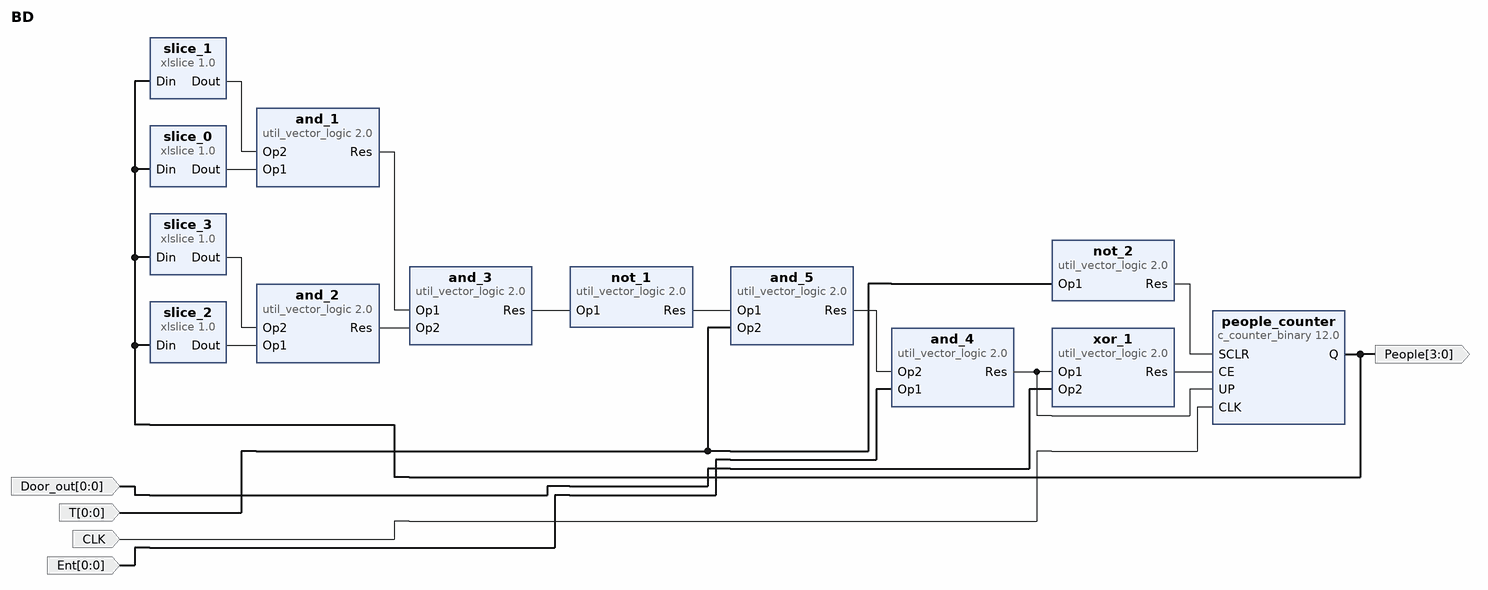
[diagram p0: block diagram of the top level]
# Vivado block design BD, xc7z020iclg400-1L, Vivado 2019.1
create_bd_design BD

create_bd_port -dir O -from 3 -to 0 -type data People
create_bd_port -dir I -from 0 -to 0 Door_out
create_bd_port -dir I -from 0 -to 0 T
create_bd_port -dir I -type clk CLK
set_property -dict {CONFIG.CLK_DOMAIN BD_CLK CONFIG.FREQ_HZ 10000000} [get_bd_ports CLK]
create_bd_port -dir I -from 0 -to 0 Ent

create_bd_cell -type ip -vlnv xilinx.com:ip:c_counter_binary:12.0 people_counter
set_property -dict {CONFIG.CE true CONFIG.Count_Mode UPDOWN CONFIG.Output_Width 4 CONFIG.SCLR true} [get_bd_cells people_counter]
create_bd_cell -type ip -vlnv xilinx.com:ip:xlslice:1.0 slice_0
set_property -dict {CONFIG.DIN_FROM 0 CONFIG.DIN_TO 0 CONFIG.DIN_WIDTH 4} [get_bd_cells slice_0]
create_bd_cell -type ip -vlnv xilinx.com:ip:xlslice:1.0 slice_1
set_property -dict {CONFIG.DIN_FROM 1 CONFIG.DIN_TO 1 CONFIG.DIN_WIDTH 4 CONFIG.DOUT_WIDTH 1} [get_bd_cells slice_1]
create_bd_cell -type ip -vlnv xilinx.com:ip:xlslice:1.0 slice_2
set_property -dict {CONFIG.DIN_FROM 2 CONFIG.DIN_TO 2 CONFIG.DIN_WIDTH 4 CONFIG.DOUT_WIDTH 1} [get_bd_cells slice_2]
create_bd_cell -type ip -vlnv xilinx.com:ip:xlslice:1.0 slice_3
set_property -dict {CONFIG.DIN_FROM 3 CONFIG.DIN_TO 3 CONFIG.DIN_WIDTH 4 CONFIG.DOUT_WIDTH 1} [get_bd_cells slice_3]
create_bd_cell -type ip -vlnv xilinx.com:ip:util_vector_logic:2.0 and_1
set_property -dict {CONFIG.C_SIZE 1} [get_bd_cells and_1]
create_bd_cell -type ip -vlnv xilinx.com:ip:util_vector_logic:2.0 and_2
set_property -dict {CONFIG.C_SIZE 1} [get_bd_cells and_2]
create_bd_cell -type ip -vlnv xilinx.com:ip:util_vector_logic:2.0 and_3
set_property -dict {CONFIG.C_SIZE 1} [get_bd_cells and_3]
create_bd_cell -type ip -vlnv xilinx.com:ip:util_vector_logic:2.0 not_1
set_property -dict {CONFIG.C_OPERATION not CONFIG.C_SIZE 1} [get_bd_cells not_1]
create_bd_cell -type ip -vlnv xilinx.com:ip:util_vector_logic:2.0 xor_1
set_property -dict {CONFIG.C_OPERATION xor CONFIG.C_SIZE 1} [get_bd_cells xor_1]
create_bd_cell -type ip -vlnv xilinx.com:ip:util_vector_logic:2.0 not_2
set_property -dict {CONFIG.C_OPERATION not CONFIG.C_SIZE 1} [get_bd_cells not_2]
create_bd_cell -type ip -vlnv xilinx.com:ip:util_vector_logic:2.0 and_4
set_property -dict {CONFIG.C_SIZE 1} [get_bd_cells and_4]
create_bd_cell -type ip -vlnv xilinx.com:ip:util_vector_logic:2.0 and_5
set_property -dict {CONFIG.C_SIZE 1} [get_bd_cells and_5]

# ---- connections ----

connect_bd_net [get_bd_pins slice_0/Dout] [get_bd_pins and_1/Op1]
connect_bd_net [get_bd_pins slice_1/Dout] [get_bd_pins and_1/Op2]
connect_bd_net [get_bd_pins slice_2/Dout] [get_bd_pins and_2/Op1]
connect_bd_net [get_bd_pins slice_3/Dout] [get_bd_pins and_2/Op2]
connect_bd_net [get_bd_pins and_2/Res] [get_bd_pins and_3/Op2]
connect_bd_net [get_bd_pins and_1/Res] [get_bd_pins and_3/Op1]
connect_bd_net [get_bd_pins and_3/Res] [get_bd_pins not_1/Op1]
connect_bd_net [get_bd_pins people_counter/Q] \
  [get_bd_ports People] [get_bd_pins slice_0/Din] [get_bd_pins slice_1/Din] [get_bd_pins slice_2/Din] \
  [get_bd_pins slice_3/Din]
connect_bd_net [get_bd_pins xor_1/Res] [get_bd_pins people_counter/CE]
connect_bd_net [get_bd_ports Door_out] [get_bd_pins xor_1/Op2]
connect_bd_net [get_bd_pins not_2/Res] [get_bd_pins people_counter/SCLR]
connect_bd_net [get_bd_ports T] [get_bd_pins not_2/Op1] [get_bd_pins and_5/Op2]
connect_bd_net [get_bd_ports CLK] [get_bd_pins people_counter/CLK]
connect_bd_net [get_bd_pins not_1/Res] [get_bd_pins and_5/Op1]
connect_bd_net [get_bd_pins and_5/Res] [get_bd_pins and_4/Op2]
connect_bd_net [get_bd_ports Ent] [get_bd_pins and_4/Op1]
connect_bd_net [get_bd_pins and_4/Res] [get_bd_pins people_counter/UP] [get_bd_pins xor_1/Op1]

validate_bd_design
save_bd_design
